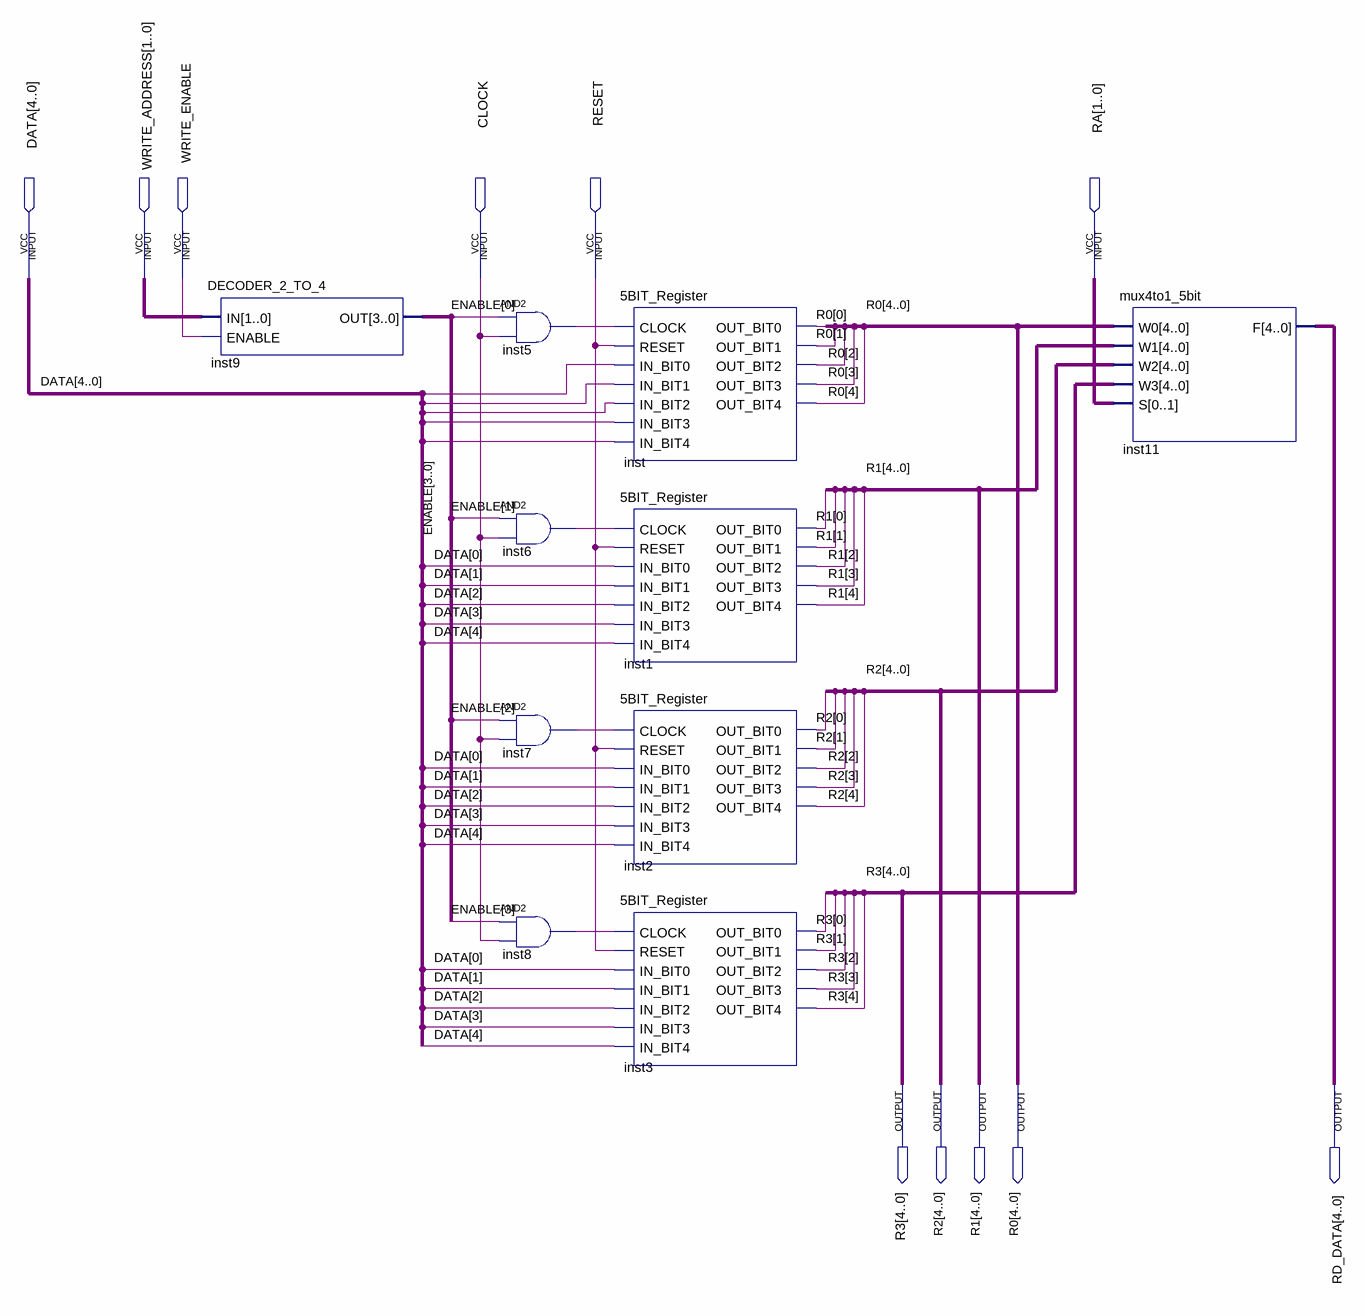
[diagram p0: schematic sheet]
// Quartus schematic REGISTER_File.bdf as structural Verilog: 10 symbols, 11 pins
module REGISTER_File (
  input  [4:0] DATA,
  input  [1:0] WRITE_ADDRESS,
  input  WRITE_ENABLE,
  input  CLOCK,
  input  RESET,
  input  [1:0] RA,
  output [4:0] R3,
  output [4:0] R2,
  output [4:0] R1,
  output [4:0] R0,
  output [4:0] RD_DATA
);

  wire inst5_out, inst6_out, inst7_out, inst8_out;
  wire [3:0] ENABLE;

  DECODER_2_TO_4 inst9 (.IN(WRITE_ADDRESS), .ENABLE(WRITE_ENABLE), .OUT(ENABLE));
  and inst5 (inst5_out, ENABLE[0], CLOCK);
  and inst6 (inst6_out, ENABLE[1], CLOCK);
  and inst7 (inst7_out, ENABLE[2], CLOCK);
  and inst8 (inst8_out, ENABLE[3], CLOCK);
  \5BIT_Register  inst (
    .CLOCK(inst5_out), .RESET(RESET), .IN_BIT0(DATA[0]), .IN_BIT1(DATA[1]), .IN_BIT2(DATA[2]),
    .IN_BIT3(DATA[3]), .IN_BIT4(DATA[4]), .OUT_BIT0(R0[0]), .OUT_BIT1(R0[1]), .OUT_BIT2(R0[2]),
    .OUT_BIT3(R0[3]), .OUT_BIT4(R0[4]));
  \5BIT_Register  inst1 (
    .CLOCK(inst6_out), .RESET(RESET), .IN_BIT0(DATA[0]), .IN_BIT1(DATA[1]), .IN_BIT2(DATA[2]),
    .IN_BIT3(DATA[3]), .IN_BIT4(DATA[4]), .OUT_BIT0(R1[0]), .OUT_BIT1(R1[1]), .OUT_BIT2(R1[2]),
    .OUT_BIT3(R1[3]), .OUT_BIT4(R1[4]));
  \5BIT_Register  inst2 (
    .CLOCK(inst7_out), .RESET(RESET), .IN_BIT0(DATA[0]), .IN_BIT1(DATA[1]), .IN_BIT2(DATA[2]),
    .IN_BIT3(DATA[3]), .IN_BIT4(DATA[4]), .OUT_BIT0(R2[0]), .OUT_BIT1(R2[1]), .OUT_BIT2(R2[2]),
    .OUT_BIT3(R2[3]), .OUT_BIT4(R2[4]));
  \5BIT_Register  inst3 (
    .CLOCK(inst8_out), .RESET(RESET), .IN_BIT0(DATA[0]), .IN_BIT1(DATA[1]), .IN_BIT2(DATA[2]),
    .IN_BIT3(DATA[3]), .IN_BIT4(DATA[4]), .OUT_BIT0(R3[0]), .OUT_BIT1(R3[1]), .OUT_BIT2(R3[2]),
    .OUT_BIT3(R3[3]), .OUT_BIT4(R3[4]));
  mux4to1_5bit inst11 (.W0(R0), .W1(R1), .W2(R2), .W3(R3), .S(RA), .F(RD_DATA));
endmodule
